# EAGLE design withAnalog (EAGLE 9.2.0)
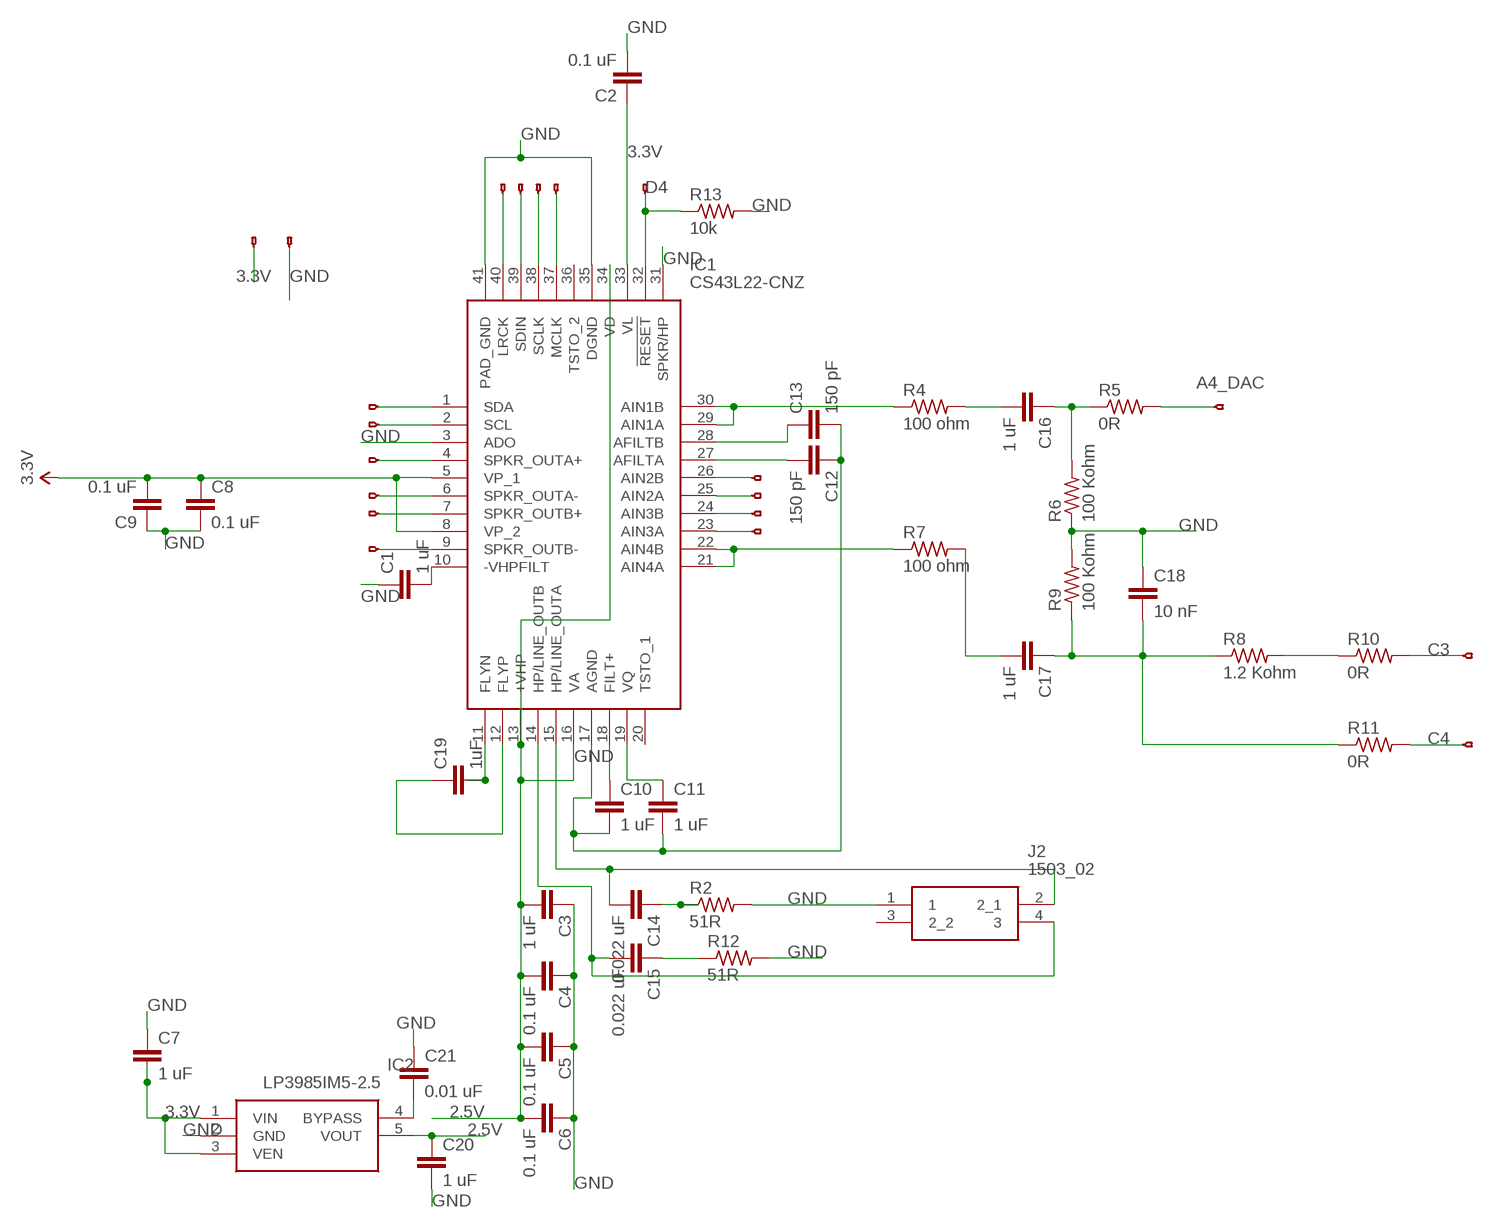
[diagram p0: schematic, sheet 1]

## Parts
C1  1 uF  CAPKIT  [CAP-PTH-SMALL-KIT]
C2  0.1 uF  CAPKIT  [CAP-PTH-SMALL-KIT]
C3  1 uF  CAPKIT  [CAP-PTH-SMALL-KIT]
C4  0.1 uF  CAPKIT  [CAP-PTH-SMALL-KIT]
C5  0.1 uF  CAPKIT  [CAP-PTH-SMALL-KIT]
C6  0.1 uF  CAPKIT  [CAP-PTH-SMALL-KIT]
C7  1 uF  CAPKIT  [CAP-PTH-SMALL-KIT]
C8  0.1 uF  CAPKIT  [CAP-PTH-SMALL-KIT]
C9  0.1 uF  CAPKIT  [CAP-PTH-SMALL-KIT]
C10  1 uF  CAPKIT  [CAP-PTH-SMALL-KIT]
C11  1 uF  CAPKIT  [CAP-PTH-SMALL-KIT]
C12  150 pF  CAPKIT  [CAP-PTH-SMALL-KIT]
C13  150 pF  CAPKIT  [CAP-PTH-SMALL-KIT]
C14  0.022 uF  CAPKIT  [CAP-PTH-SMALL-KIT]
C15  0.022 uF  CAPKIT  [CAP-PTH-SMALL-KIT]
C16  1 uF  CAPKIT  [CAP-PTH-SMALL-KIT]
C17  1 uF  CAPKIT  [CAP-PTH-SMALL-KIT]
C18  10 nF  CAPKIT  [CAP-PTH-SMALL-KIT]
C19  1uF  C2,5-3  [C2.5-3]
C20  1 uF  CAPKIT  [CAP-PTH-SMALL-KIT]
C21  0.01 uF  CAPKIT  [CAP-PTH-SMALL-KIT]
IC1  CS43L22-CNZ  [QFN50P600X600X100-41N]
IC2  LP3985IM5-2.5  [SOT95P300X120-5N]
J2  1503_02  [150302]
JP1  HEADERHOLE-HEADERHOLE  [1X1-HEADER-HOLE]
JP2  HEADERHOLE-HEADERHOLE  [1X1-HEADER-HOLE]
JP3  HEADERHOLE-HEADERHOLE  [1X1-HEADER-HOLE]
JP4  HEADERHOLE-HEADERHOLE  [1X1-HEADER-HOLE]
JP5  HEADERHOLE-HEADERHOLE  [1X1-HEADER-HOLE]
JP6  HEADERHOLE-HEADERHOLE  [1X1-HEADER-HOLE]
JP7  HEADERHOLE-HEADERHOLE  [1X1-HEADER-HOLE]
JP8  HEADERHOLE-HEADERHOLE  [1X1-HEADER-HOLE]
JP9  HEADERHOLE-HEADERHOLE  [1X1-HEADER-HOLE]
JP10  HEADERHOLE-HEADERHOLE  [1X1-HEADER-HOLE]
JP11  HEADERHOLE-HEADERHOLE  [1X1-HEADER-HOLE]
JP12  HEADERHOLE-HEADERHOLE  [1X1-HEADER-HOLE]
JP13  HEADERHOLE-HEADERHOLE  [1X1-HEADER-HOLE]
JP14  HEADERHOLE-HEADERHOLE  [1X1-HEADER-HOLE]
JP15  HEADERHOLE-HEADERHOLE  [1X1-HEADER-HOLE]
JP16  HEADERHOLE-HEADERHOLE  [1X1-HEADER-HOLE]
JP17  HEADERHOLE-HEADERHOLE  [1X1-HEADER-HOLE]
JP20  HEADERHOLE-HEADERHOLE  [1X1-HEADER-HOLE]
JP21  HEADERHOLE-HEADERHOLE  [1X1-HEADER-HOLE]
JP22  HEADERHOLE-HEADERHOLE  [1X1-HEADER-HOLE]
R2  51R  R-US_0204/2V  [0204V]
R4  100 ohm  R-US_0204/2V  [0204V]
R5  0R  R-US_0204/2V  [0204V]
R6  100 Kohm  R-US_0204/2V  [0204V]
R7  100 ohm  R-US_0204/2V  [0204V]
R8  1.2 Kohm  R-US_0204/2V  [0204V]
R9  100 Kohm  R-US_0204/2V  [0204V]
R10  0R  R-US_0204/2V  [0204V]
R11  0R  R-US_0204/2V  [0204V]
R12  51R  R-US_0204/2V  [0204V]
R13  10k  R-US_0204/2V  [0204V]

## Nets
2.5V: C3.2 C4.2 C5.2 C6.2 C20.1 IC1.13(+VHP) IC1.16(VA) IC1.34(VD) IC2.5(VOUT)
3.3V: C2.1 C7.2 C8.1 C9.2 IC1.5(VP_1) IC1.8(VP_2) IC1.33(VL) IC2.1(VIN) IC2.3(VEN) JP8.1
A4_DAC: JP20.1 R5.2
C3: JP21.1 R10.2
C4: JP22.1 R11.2
D4: IC1.32(!RESET) JP7.1 R13.1
GND: C1.1 C2.2 C3.1 C4.1 C5.1 C6.1 C7.1 C8.2 C9.1 C10.2 C11.2 C12.1 C13.2 C18.1 C20.2 C21.1 IC1.3(ADO) IC1.17(AGND) IC1.31(SPKR/HP) IC1.35(DGND) IC1.41(PAD_GND) IC2.2(GND) J2.1 JP9.1 R2.2 R6.1 R9.2 R12.2 R13.2
N$1: C19.2 IC1.11(FLYN)
N$2: IC1.1(SDA) JP1.1
N$3: IC1.2(SCL) JP2.1
N$4: IC1.37(MCLK) JP3.1
N$5: IC1.38(SCLK) JP4.1
N$6: IC1.39(SDIN) JP5.1
N$7: IC1.40(LRCK) JP6.1
N$8: C21.2 IC2.4(BYPASS)
N$9: C1.2 IC1.10(-VHPFILT)
N$10: C19.1 IC1.12(FLYP)
N$11: C11.1 IC1.19(VQ)
N$12: C16.2 R4.2
N$13: C12.2 IC1.27(AFILTA)
N$14: C13.1 IC1.28(AFILTB)
N$15: C14.2 IC1.15(HP/LINE_OUTA) J2.2(2_1)
N$16: C10.1 IC1.18(FILT+)
N$17: C15.2 IC1.14(HP/LINE_OUTB) J2.4
N$18: C14.1 R2.1
N$19: C15.1 R12.1
N$20: C16.1 R5.1 R6.2
N$21: IC1.4(SPKR_OUTA+) JP10.1
N$22: IC1.6(SPKR_OUTA-) JP11.1
N$23: IC1.7(SPKR_OUTB+) JP12.1
N$24: IC1.9(SPKR_OUTB-) JP13.1
N$25: IC1.26(AIN2B) JP17.1
N$26: IC1.25(AIN2A) JP16.1
N$27: IC1.24(AIN3B) JP15.1
N$28: IC1.23(AIN3A) JP14.1
N$31: IC1.29(AIN1A) IC1.30(AIN1B) R4.1
N$32: IC1.21(AIN4A) IC1.22(AIN4B) R7.1
N$33: C17.2 R7.2
N$35: C17.1 C18.2 R8.1 R9.1 R11.1
N$36: R8.2 R10.1
Unconnected: IC1.20(TSTO_1) IC1.36(TSTO_2) J2.3(2_2)

## Library data of the parts
C1-C18 C20 C21 = F405Pill:CAP: Capacitor Standard 0603 ceramic capacitor, and 0.1" leaded capacitor.
C19 = capacitor-wima:C: CAPACITOR naming: grid - package width
IC1 = CS43L22-CNZ:CS43L22-CNZ: CS43L22-CNZ, Audio DAC 24 bit-, 96ksps Serial, 40-Pin QFN Source: Datasheet <https://d3uzseaevmutz1.cloudfront.net/pubs/proDatasheet/CS43L22_F2.pdf>; DESCRIPTION: CS43L22-CNZ, Audio DAC 24 bit-, 96ksps Serial, 40-Pin QFN; HEIGHT: 1mm; MANUFACTURER_NAME: Cirrus Logic; MANUFACTURER_PART_NUMBER: CS43L22-CNZ; MOUSER_PART_NUMBER: 777-CS43L22-CNZ; MOUSER_PRICE-STOCK: https://www.mouser.com/Search/Refine.aspx?Keyword=777-CS43L22-CNZ; RS_PART_NUMBER: 7165851P; RS_PRICE-STOCK: http://uk.rs-online.com/web/p/products/7165851P
IC2 = LP3985IM5-2.5:LP3985IM5-2.5: Low-Dropout CMOS Voltage Regulator Source: Datasheet; DESCRIPTION: Low-Dropout CMOS Voltage Regulator; HEIGHT: mm; MANUFACTURER_NAME: Texas Instruments; MANUFACTURER_PART_NUMBER: LP3985IM5-2.5; MOUSER_PART_NUMBER: 926-LP3985IM5-25; MOUSER_PRICE-STOCK: https://www.mouser.com/Search/Refine.aspx?Keyword=926-LP3985IM5-25; RS_PART_NUMBER: 4433167; RS_PRICE-STOCK: https://uk.rs-online.com/web/p/products/4433167
J2 = 1503_02:1503_02: LUMBERG - 1503 02 - CONNECTOR, RECEPTACLE, 3.5MM PHONO, 3WAY Source: Datasheet <http://www.farnell.com/datasheets/2047485.pdf>; DESCRIPTION: LUMBERG - 1503 02 - CONNECTOR, RECEPTACLE, 3.5MM PHONO, 3WAY; HEIGHT: 5mm; MANUFACTURER_NAME: LUMBERG; MANUFACTURER_PART_NUMBER: 1503 02
JP1-JP17 JP20-JP22 = F405Pill:HEADERHOLE
R2 R4-R13 = rcl:R-US_: RESISTOR, American symbol; SPICEPREFIX: R

## Board
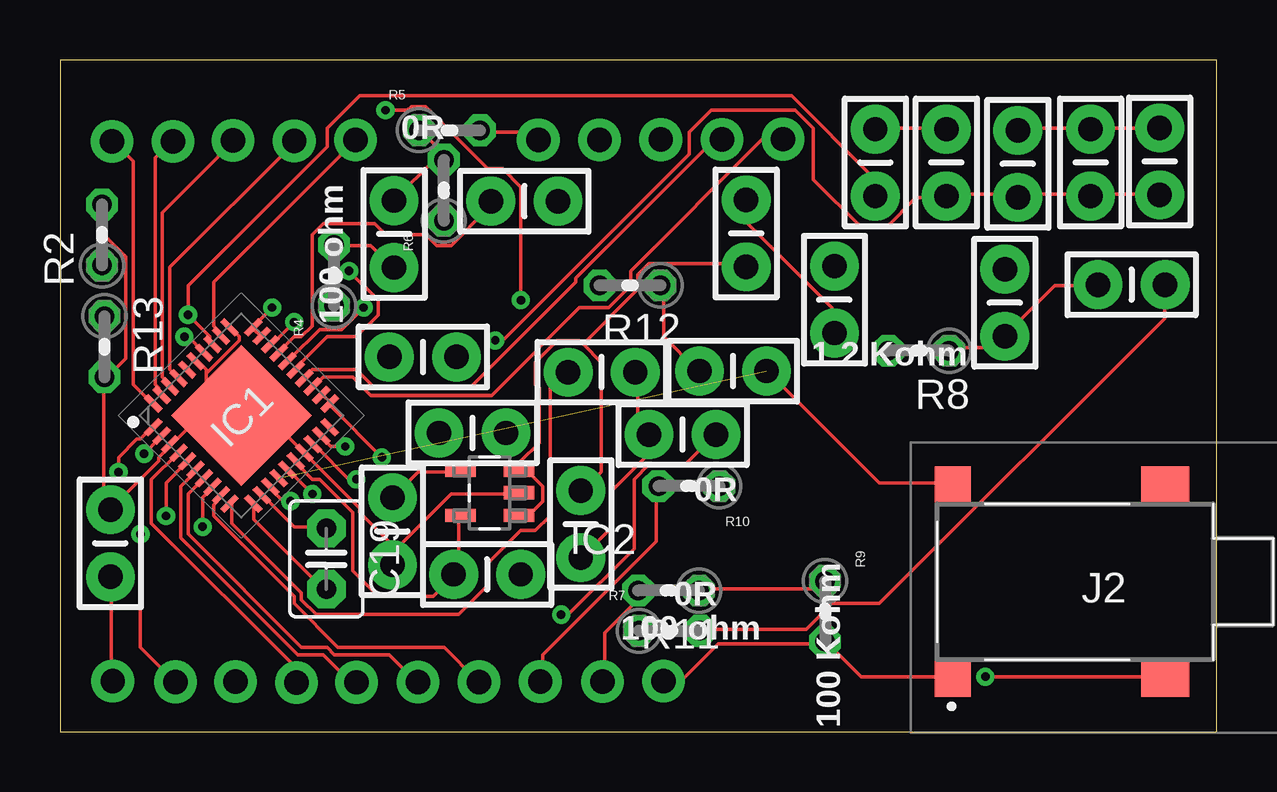
[diagram p1: board, top side]
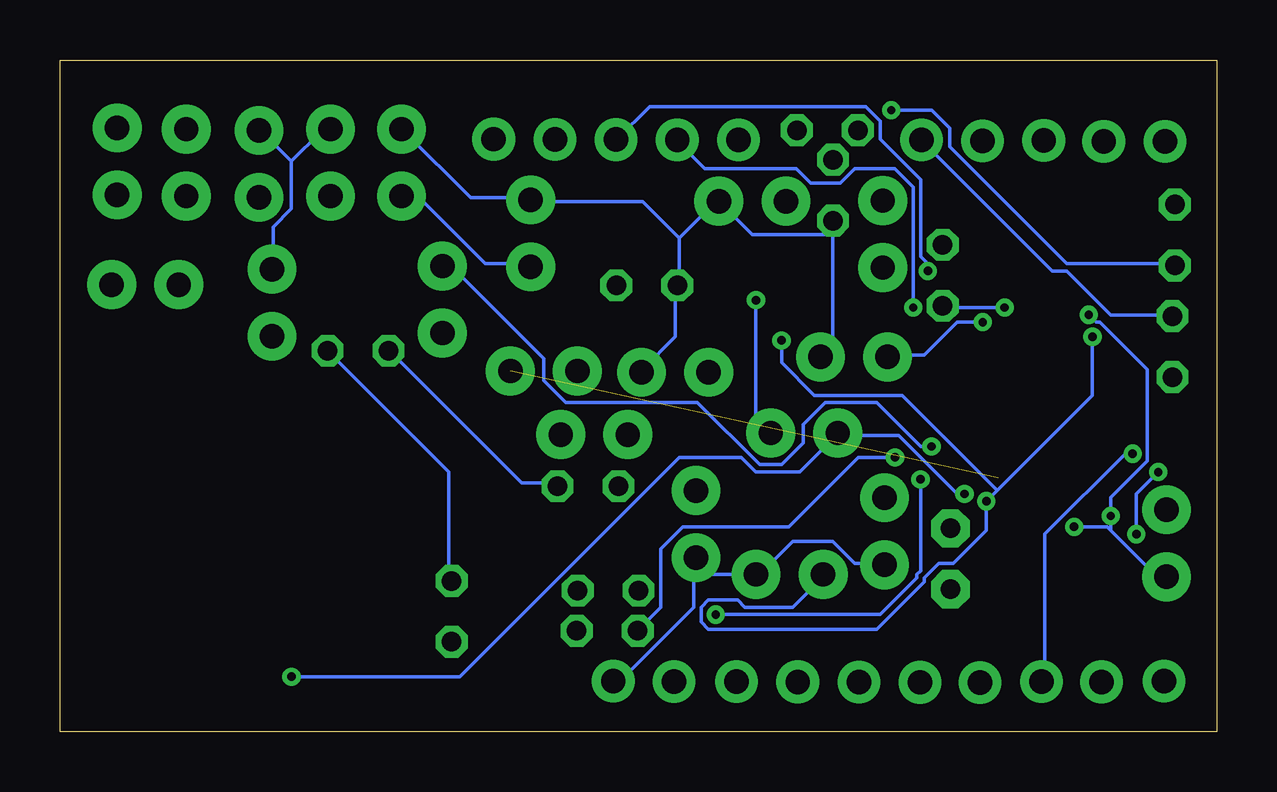
[diagram p2: board, bottom side, seen from below]

Size 48.2 x 28 mm. Coordinates in mm from the lower left corner, seen from the top.
Outline: 0,0 48.2,0 48.2,28 0,28 0,0
Copper layers (1*16): Top 0.035mm / dielectric 1.5mm / Bottom 0.035mm
Design rules "default": minimum track width 6mil, minimum drill 0.35mm, track to track 6mil, track to pad 6mil, pad to pad 6mil, via to via 6mil, smd to smd 6mil, copper to edge 40mil, drill to drill 6mil, minimum pad ring 10mil, minimum via ring 8mil, stop-mask expansion 4mil, vias tented up to drill 0mil, thermal gap 10mil

### Footprints (pad centres in the part's own frame; a part is rotated, then mirrored left to right if it is on the bottom)
CAP-PTH-SMALL-KIT = drill 1.016 pad 2.032: 1 -1.397,0; 2 1.397,0
C2.5-3 = drill 0.813 pad 1.6 octagon: 1 -1.27,0; 2 1.27,0
QFN50P600X600X100-41N = smd 0.85 x 0.25: 1 -2.95,2.25; 2 -2.95,1.75; 3 -2.95,1.25; 4 -2.95,0.75; 5 -2.95,0.25; 6 -2.95,-0.25; 7 -2.95,-0.75; 8 -2.95,-1.25; 9 -2.95,-1.75; 10 -2.95,-2.25; 21 2.95,-2.25; 22 2.95,-1.75; 23 2.95,-1.25; 24 2.95,-0.75; 25 2.95,-0.25; 26 2.95,0.25; 27 2.95,0.75; 28 2.95,1.25; 29 2.95,1.75; 30 2.95,2.25 | smd 0.25 x 0.85: 11 -2.25,-2.95; 12 -1.75,-2.95; 13 -1.25,-2.95; 14 -0.75,-2.95; 15 -0.25,-2.95; 16 0.25,-2.95; 17 0.75,-2.95; 18 1.25,-2.95; 19 1.75,-2.95; 20 2.25,-2.95; 31 2.25,2.95; 32 1.75,2.95; 33 1.25,2.95; 34 0.75,2.95; 35 0.25,2.95; 36 -0.25,2.95; 37 -0.75,2.95; 38 -1.25,2.95; 39 -1.75,2.95; 40 -2.25,2.95 | smd 4.15 x 4.15: 41 0,0
SOT95P300X120-5N = smd 1.27 x 0.559: 1 -1.219,0.94; 2 -1.219,0; 3 -1.219,-0.94; 4 1.219,-0.94; 5 1.219,0.94
150302 = smd 1.5 x 1.5: 1 6.3,3.8; 4 6.3,-4.3 | smd 2 x 1.5: 2 -2.55,3.8; 3 -2.55,-4.3
1X1-HEADER-HOLE = drill 1.016 pad 1.778: 1 0,0
0204V = drill 0.813 octagon: 1 -1.27,0; 2 1.27,0

### Placement (x,y rotation side)
C1  22.57,14.98 180 top
C2  2.1,7.85 90 top
C3  45.82,23.77 270 top
C4  42.94,23.72 270 top
C5  39.91,23.67 270 top
C6  36.93,23.72 270 top
C7  21.7,8.65 90 top
C8  33.97,23.72 90 top
C9  28.59,20.77 270 top
C10  25.94,12.38 180 top
C11  32.27,18.01 270 top
C12  19.35,22.11 180 top
C13  15.12,15.62 0 top
C14  17.19,12.45 180 top
C15  28.04,15.03 0 top
C16  13.92,20.74 270 top
C17  44.65,18.63 0 top
C18  39.37,17.88 270 top
C19  11.1,7.2 270 top
C20  17.8,6.55 0 top
C21  13.85,8.35 90 top
IC1  7.56,13.18 45 top
IC2  17.9,9.95 180 top
J2  43.5,6 180 top
JP1  4.81,2.07 0 top
JP2  7.31,2.08 0 top
JP3  9.76,24.63 0 top
JP4  7.21,24.64 0 top
JP5  4.71,24.6 0 top
JP6  2.16,24.61 0 top
JP7  12.31,24.66 0 top
JP8  2.2,2.1 0 top
JP9  25.15,2.1 0 top
JP10  9.86,2.04 0 top
JP11  12.36,2.05 0 top
JP12  14.91,2.06 0 top
JP13  17.46,2.07 0 top
JP14  30.13,24.7 0 top
JP15  27.58,24.69 0 top
JP16  25.03,24.68 0 top
JP17  22.48,24.67 0 top
JP20  19.93,24.66 0 top
JP21  20.01,2.08 0 top
JP22  22.61,2.09 0 top
R2  1.75,20.7 90 top
R4  11.42,19.02 90 top
R5  16.23,25.07 0 top
R6  15.99,22.57 90 top
R7  25.4,4.2 0 top
R8  35.78,15.88 180 top
R9  31.88,5.01 270 top
R10  26.2,10.23 180 top
R11  25.36,5.88 180 top
R12  23.75,18.6 180 top
R13  1.85,16.05 270 top

### Tracks (layer width: path | path; a pad name or v marks a point on that pad's centre or on a via)
2.5V  (via drill 0.35)
  Top 0.152: C3.2 45.72,22.4 42.98,22.4 C4.2 42.82,22.4 39.93,22.4 C5.2 39.78,22.4 37.03,22.4 C6.2 36.88,22.25 35.66,22.25 34.44,21.03 33.38,21.03 31.39,23.01 31.39,25.15 30.63,25.91 27.13,25.91 26.21,24.99 26.21,24.08 18.44,16.31 v18.14,16.31 | v9.6,9.6 9.3,9.6 8.84,10.06 IC1.13 | IC1.16 9.91,11.12 10.52,10.52 10.82,10.52 12.19,9.14 12.19,6.71 13.26,5.64 15.54,5.64 16.31,6.4 C20.1 16.46,6.55 16.61,6.71 16.61,8.99 IC2.5 | v5.18,16.46 5.33,16.46 5.94,15.85 IC1.34
  Bottom 0.152: C20.1 16.46,6.4 17.68,5.18 19.66,5.18 19.96,5.49 21.18,5.49 21.49,5.18 21.49,4.57 21.18,4.27 14.17,4.27 12.19,6.25 12.19,6.4 11.58,7.01 10.97,7.01 9.6,8.38 v9.6,9.6 9.14,10.06 | v5.18,16.46 5.18,14.02 9.14,10.06 | v18.14,16.31 18.14,15.39 16.76,14.02 13.11,14.02 9.14,10.06
3.3V  (via drill 0.35)
  Top 0.152: v5.94,8.53 5.94,9.75 6.25,10.06 IC1.8 | v4.42,8.99 4.42,10.36 5.18,11.12 IC1.5 | IC1.33 6.25,16.15 6.25,16.46 v5.33,17.37 5.33,18.59 11.12,24.38 11.12,25.15 12.5,26.52 30.48,26.52 33.83,23.16 33.83,22.4 C8.1 | JP8.1 2.13,2.13 2.13,6.4 C2.1 | IC2.1 19.2,9.14 19.66,9.14 20.12,9.6 20.12,10.21 19.51,10.82 19.2,10.82 IC2.3 19.2,10.97 19.2,11.28 19.96,12.04 19.96,14.33 19.81,14.48 19.81,15.39 20.73,16.31 21.64,16.31 21.79,16.15 | 21.79,16.15 22.55,15.39 22.55,10.82 21.79,10.06 C7.2 | 21.79,16.15 24.08,18.44 24.08,19.05 24.54,19.51 28.5,19.51 C9.2
  Bottom 0.152: v5.94,8.53 4.57,8.53 4.42,8.38 | 4.42,8.38 2.59,6.55 2.13,6.55 C2.1 | 4.42,8.38 v4.42,8.99 4.42,9.75 2.9,11.28 2.9,15.09 4.88,17.07 5.03,17.07 v5.33,17.37 | C9.2 28.65,19.51 30.48,19.51 33.22,22.25 33.83,22.25 C8.1
A4_DAC
  Top 0.152: R5.2 17.53,24.99 19.51,24.99 19.81,24.69 JP20.1
C3
  Top 0.152: R10.2 24.84,10.21 24.84,7.92 20.12,3.2 20.12,2.13 JP21.1
C4
  Top 0.152: R11.2 24.08,5.79 24.08,5.49 22.71,4.12 22.71,2.13 JP22.1
D4
  Top 0.152: IC1.32 6.71,16.61 6.4,16.92 6.4,18.75 12.19,24.54 JP7.1
  Bottom 0.152: R13.1 1.98,17.37 4.42,17.37 6.25,19.2 6.86,19.2 12.19,24.54 JP7.1
GND
  Top 0.152: 14.02,7.62 13.87,7.47 13.87,7.01 C21.1 14.02,7.62 | 14.02,7.62 16.31,9.91 19.05,9.91 IC2.2 | 6.1,13.11 7.47,13.11 IC1.41 | 6.1,13.11 5.79,13.11 4.72,12.04 IC1.3 4.57,11.89 4.12,11.43 4.12,11.28 2.13,9.3 C2.2 1.98,9.3 1.83,9.45 1.83,14.63 R13.2 1.98,14.78 2.74,15.54 2.74,19.81 1.83,20.73 1.83,21.95 R2.2 | 6.1,13.11 6.1,14.94 | 6.1,14.94 6.1,15.09 5.79,15.39 IC1.35 | 6.1,13.11 IC1.41 | 6.1,14.94 7.47,16.31 7.47,16.46 7.16,16.76 IC1.31 | IC1.41 7.62,13.11 8.69,13.11 10.06,11.73 IC1.17 10.21,11.58 12.5,9.3 12.5,9.14 14.02,7.62 | C11.2 32.16,16.76 32.16,17.68 28.65,21.18 28.65,22.1 C9.1 | C8.2 33.98,25.15 36.88,25.15 C6.1 | C3.1 45.72,25.15 42.98,25.15 C4.1 42.82,25.15 39.93,25.15 C5.1 | C1.1 24.08,14.94 24.08,12.95 24.54,12.5 C10.2 24.54,12.34 24.54,11.58 23.01,10.06 23.01,8.53 21.79,7.32 C7.1 | J2.1 37.19,2.29 33.38,2.29 32,3.66 R9.2 31.85,3.66 27.43,3.66 25.91,2.13 25.3,2.13 JP9.1
  Bottom 0.152: 38.56,23.77 38.56,21.79 39.32,21.03 39.32,19.36 C18.1 | 38.56,23.77 39.78,24.99 C5.1 | 38.56,23.77 37.34,24.99 37.03,24.99 C6.1 | C8.2 33.83,24.99 31.09,22.25 28.65,22.25 C9.1 28.5,22.1 23.93,22.1 22.4,20.57 | 16,20.73 16,16.15 16.46,15.7 C13.2 | 16,20.73 16,21.18 R6.1 16,20.73 | 22.4,20.57 22.4,18.75 R12.2 22.55,18.59 22.55,16.46 23.93,15.09 C1.1 | 22.4,20.57 20.88,22.1 C12.1 20.73,22.1 19.36,20.73 16,20.73 | 21.79,6.55 21.79,7.16 C7.1 21.79,6.55 | 21.79,6.55 21.79,5.18 24.84,2.13 25.15,2.13 JP9.1 | 21.79,6.55 C20.2 19.05,6.55 17.68,7.92 16,7.92 15.09,7.01 13.87,7.01 C21.1
N$1
  Top 0.152: IC1.11 8.08,9.45 8.08,8.84 10.97,5.94 C19.2
N$2  (via drill 0.35)
  Top 0.152: v2.44,10.82 2.44,11.43 3.2,12.19 3.35,12.19 3.81,12.65 IC1.1 | v3.35,8.23 3.35,3.5 4.72,2.13 JP1.1
  Bottom 0.152: v2.44,10.82 3.35,9.91 v3.35,8.23
N$3  (via drill 0.35)
  Top 0.152: v3.5,11.58 4.12,12.19 IC1.2
  Bottom 0.152: v3.5,11.58 3.81,11.58 7.16,8.23 7.16,2.13 JP2.1
N$4
  Top 0.152: IC1.37 4.88,14.78 4.57,15.09 4.57,19.36 9.75,24.54 JP3.1
N$5
  Top 0.152: IC1.38 4.57,14.48 4.27,14.78 4.27,21.64 7.16,24.54 JP4.1
N$6
  Top 0.152: IC1.39 4.12,14.17 4.12,14.33 3.96,14.48 3.96,23.93 4.57,24.54 JP5.1
N$7
  Top 0.152: IC1.40 3.81,13.72 3.05,14.48 3.05,23.77 2.29,24.54 JP6.1
N$8
  Top 0.152: IC2.4 16.61,10.82 14.94,10.82 13.87,9.75 C21.2
N$9
  Top 0.152: IC1.10 7.16,9.45 7.16,8.69 10.06,5.79 10.06,5.49 10.67,4.88 16.61,4.88 17.83,6.1 17.83,7.01 19.2,8.38 19.81,8.38 20.42,8.99 20.42,14.33 21.03,14.94 C1.2
N$10
  Top 0.152: IC1.12 8.53,9.75 9.75,8.53 10.97,8.53 C19.1
N$11  (via drill 0.35)
  Top 0.152: v11.89,11.89 11.28,11.89 10.97,12.19 IC1.19
  Bottom 0.152: v11.89,11.89 12.34,11.89 14.17,13.72 16.31,13.72 17.22,12.8 17.22,12.04 18.14,11.12 19.05,11.12 21.64,13.72 27.13,13.72 28.04,14.63 28.04,15.54 31.85,19.36 32.16,19.36 C11.1
N$12
  Top 0.152: R4.2 11.43,20.27 12.95,20.27 13.87,19.36 C16.2
N$13
  Top 0.152: IC1.27 9.14,15.85 9.75,16.46 10.06,16.46 10.52,16.92 10.52,20.73 10.97,21.18 13.11,21.18 13.56,20.73 15.24,20.73 15.7,20.27 16.31,20.27 17.83,21.79 17.83,22.1 C12.2
N$14  (via drill 0.35)
  Top 0.152: v9.75,17.07 8.84,16.15 IC1.28
  Bottom 0.152: v9.75,17.07 10.82,17.07 12.19,15.7 13.72,15.7 C13.1
N$15  (via drill 0.35)
  Top 0.152: v10.52,9.91 9.6,10.82 IC1.15 | v38.56,2.29 46.02,2.29 J2.2
  Bottom 0.152: v10.52,9.91 10.82,9.91 13.26,12.34 15.7,12.34 C14.2 15.85,12.34 17.37,10.82 19.2,10.82 19.81,11.43 22.4,11.43 31.55,2.29 v38.56,2.29
N$16  (via drill 0.35)
  Top 0.152: v12.34,10.52 12.04,10.52 10.67,11.89 IC1.18 | v20.88,4.88 21.18,4.88 23.93,7.62 23.93,10.52 24.54,11.12 26.06,11.12 27.28,12.34 C10.1
  Bottom 0.152: v12.34,10.52 12.34,6.71 12.5,6.55 12.5,6.4 14.02,4.88 v20.88,4.88
N$17  (1 unrouted)
  Top 0.152: J2.4 37.19,10.36 34.14,10.36 29.57,14.94 C15.2
N$18  (via drill 0.35)
  Top 0.152: v13.56,25.91 14.48,25.91 14.63,26.06 15.24,26.06 17.83,23.47 18.44,23.47 19.2,22.71 v19.2,17.98
  Bottom 0.152: v13.56,25.91 11.89,25.91 11.12,25.15 11.12,24.38 6.25,19.51 1.83,19.51 R2.1 | v19.2,17.98 19.2,13.11 18.59,12.5 C14.1
N$19
  Top 0.152: R12.1 25.15,18.59 25.15,16.46 26.52,15.09 C15.1
N$20
  Top 0.152: R5.1 15.09,24.99 15.85,24.23 15.85,23.93 R6.2 15.85,23.77 15.54,23.77 14.02,22.25 C16.1
N$21
  Top 0.152: IC1.4 4.88,11.58 3.81,10.52 3.81,8.69 9.75,2.74 9.75,2.13 JP10.1
N$22
  Top 0.152: IC1.6 5.64,10.82 5.03,10.21 5.03,8.08 9.91,3.2 10.97,3.2 12.04,2.13 12.34,2.13 JP11.1
N$23
  Top 0.152: IC1.7 5.94,10.52 5.33,9.91 5.33,8.23 10.06,3.5 11.12,3.5 11.43,3.2 13.72,3.2 14.78,2.13 JP12.1
N$24
  Top 0.152: IC1.9 6.71,9.75 6.4,9.45 6.4,8.99 9.75,5.64 9.75,5.33 11.58,3.5 16,3.5 17.37,2.13 JP13.1
N$25  (via drill 0.35)
  Top 0.152: v12.65,17.68 11.73,16.76 10.82,16.76 9.6,15.54 IC1.26
  Bottom 0.152: v12.65,17.68 12.65,22.71 13.41,23.47 15.09,23.47 15.7,22.86 16.92,22.86 17.53,23.47 21.34,23.47 22.4,24.54 JP17.1
N$26  (via drill 0.35)
  Top 0.152: v12.04,19.2 13.26,17.98 13.26,17.37 12.34,16.46 11.12,16.46 9.91,15.24 IC1.25
  Bottom 0.152: v12.04,19.2 12.04,19.51 12.34,19.81 12.34,23.01 14.02,24.69 14.02,25.45 14.63,26.06 23.62,26.06 24.99,24.69 JP16.1
N$27
  Top 0.152: IC1.24 10.21,14.78 10.52,15.09 12.34,15.09 13.11,14.33 17.07,14.33 21.49,18.75 21.49,18.9 27.43,24.84 JP15.1
N$28
  Top 0.152: IC1.23 10.67,14.48 10.97,14.78 12.19,14.78 12.95,14.02 17.98,14.02 21.64,17.68 22.86,17.68 23.77,18.59 23.77,19.2 29.26,24.69 30.02,24.69 JP14.1
N$31  (via drill 0.35)
  Top 0.152: IC1.29 8.38,16.46 8.08,16.76 IC1.30 8.08,16.92 v8.84,17.68
  Bottom 0.152: v8.84,17.68 11.28,17.68 R4.1
N$32  (via drill 0.35)
  Top 0.152: IC1.22 10.97,14.02 11.28,13.72 IC1.21 11.28,13.56 v13.41,11.43
  Bottom 0.152: v13.41,11.43 14.94,11.43 17.83,8.53 22.25,8.53 23.16,7.62 23.16,5.18 24.08,4.27 R7.1
N$33
  Top 0.152: R7.2 26.67,4.27 31.09,4.27 32.16,5.33 34.14,5.33 46.02,17.22 46.02,18.59 C17.2
N$35
  Top 0.152: R11.1 26.67,5.94 31.55,5.94 31.85,6.25 R9.1 | R8.1 37.19,16 38.86,16 39.32,16.46 C18.2 39.47,16.61 41.45,18.59 43.13,18.59 C17.1
  Bottom 0.152: R9.1 32,6.4 32,10.82 37.03,15.85 R8.1
N$36
  Bottom 0.152: R10.1 27.58,10.36 28.96,10.36 34.44,15.85 R8.2